# EAGLE schematic exp2_Blueberry Pi 7.1.2.licheepi-zero.esp32.no-lan.gsm-a9g.no-50p (EAGLE 6.1)

## Sheet 1 of 8: IO / LRADC / RTL8237BS / Touch / SPI Flash
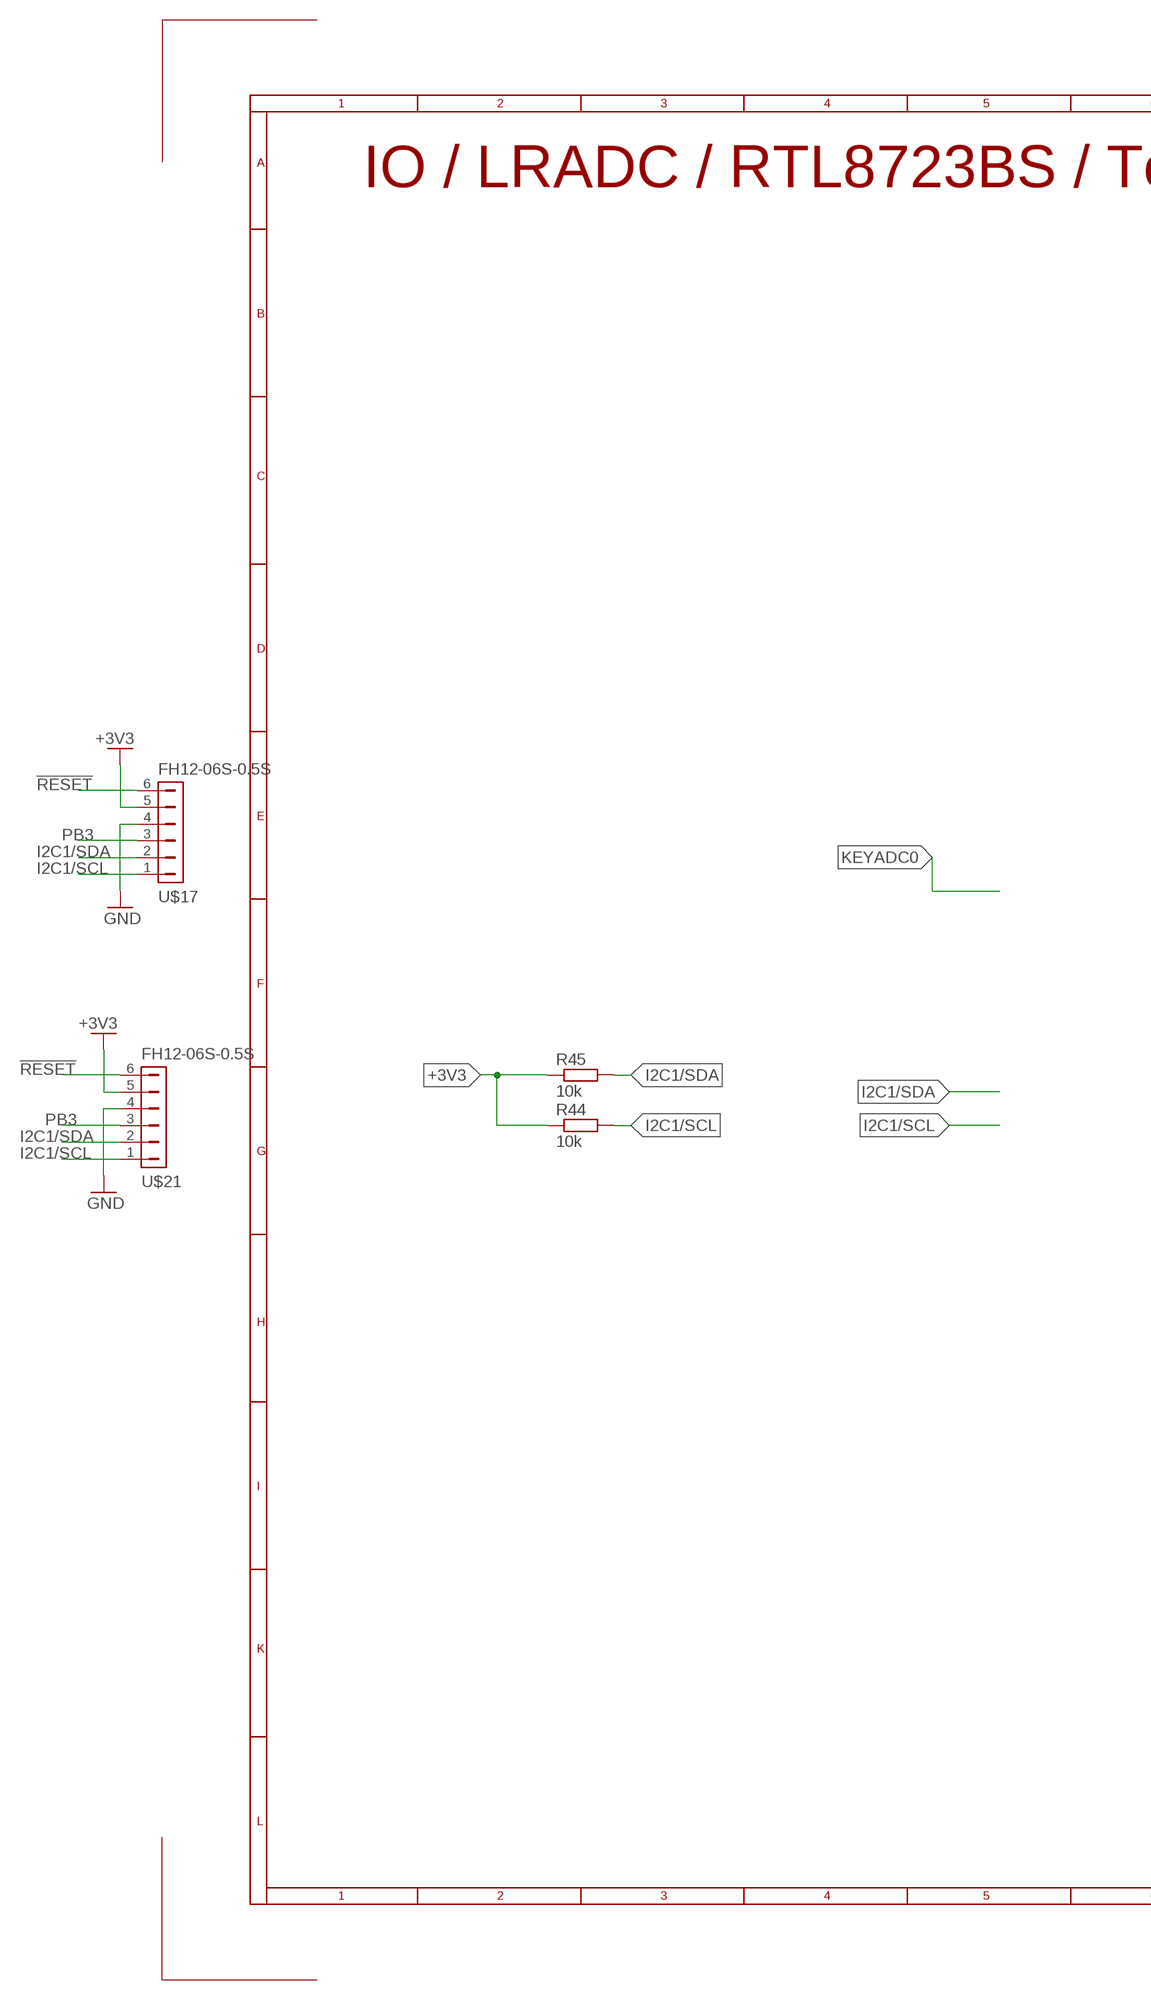
[diagram p0: schematic, sheet 1, part 1 of 2]
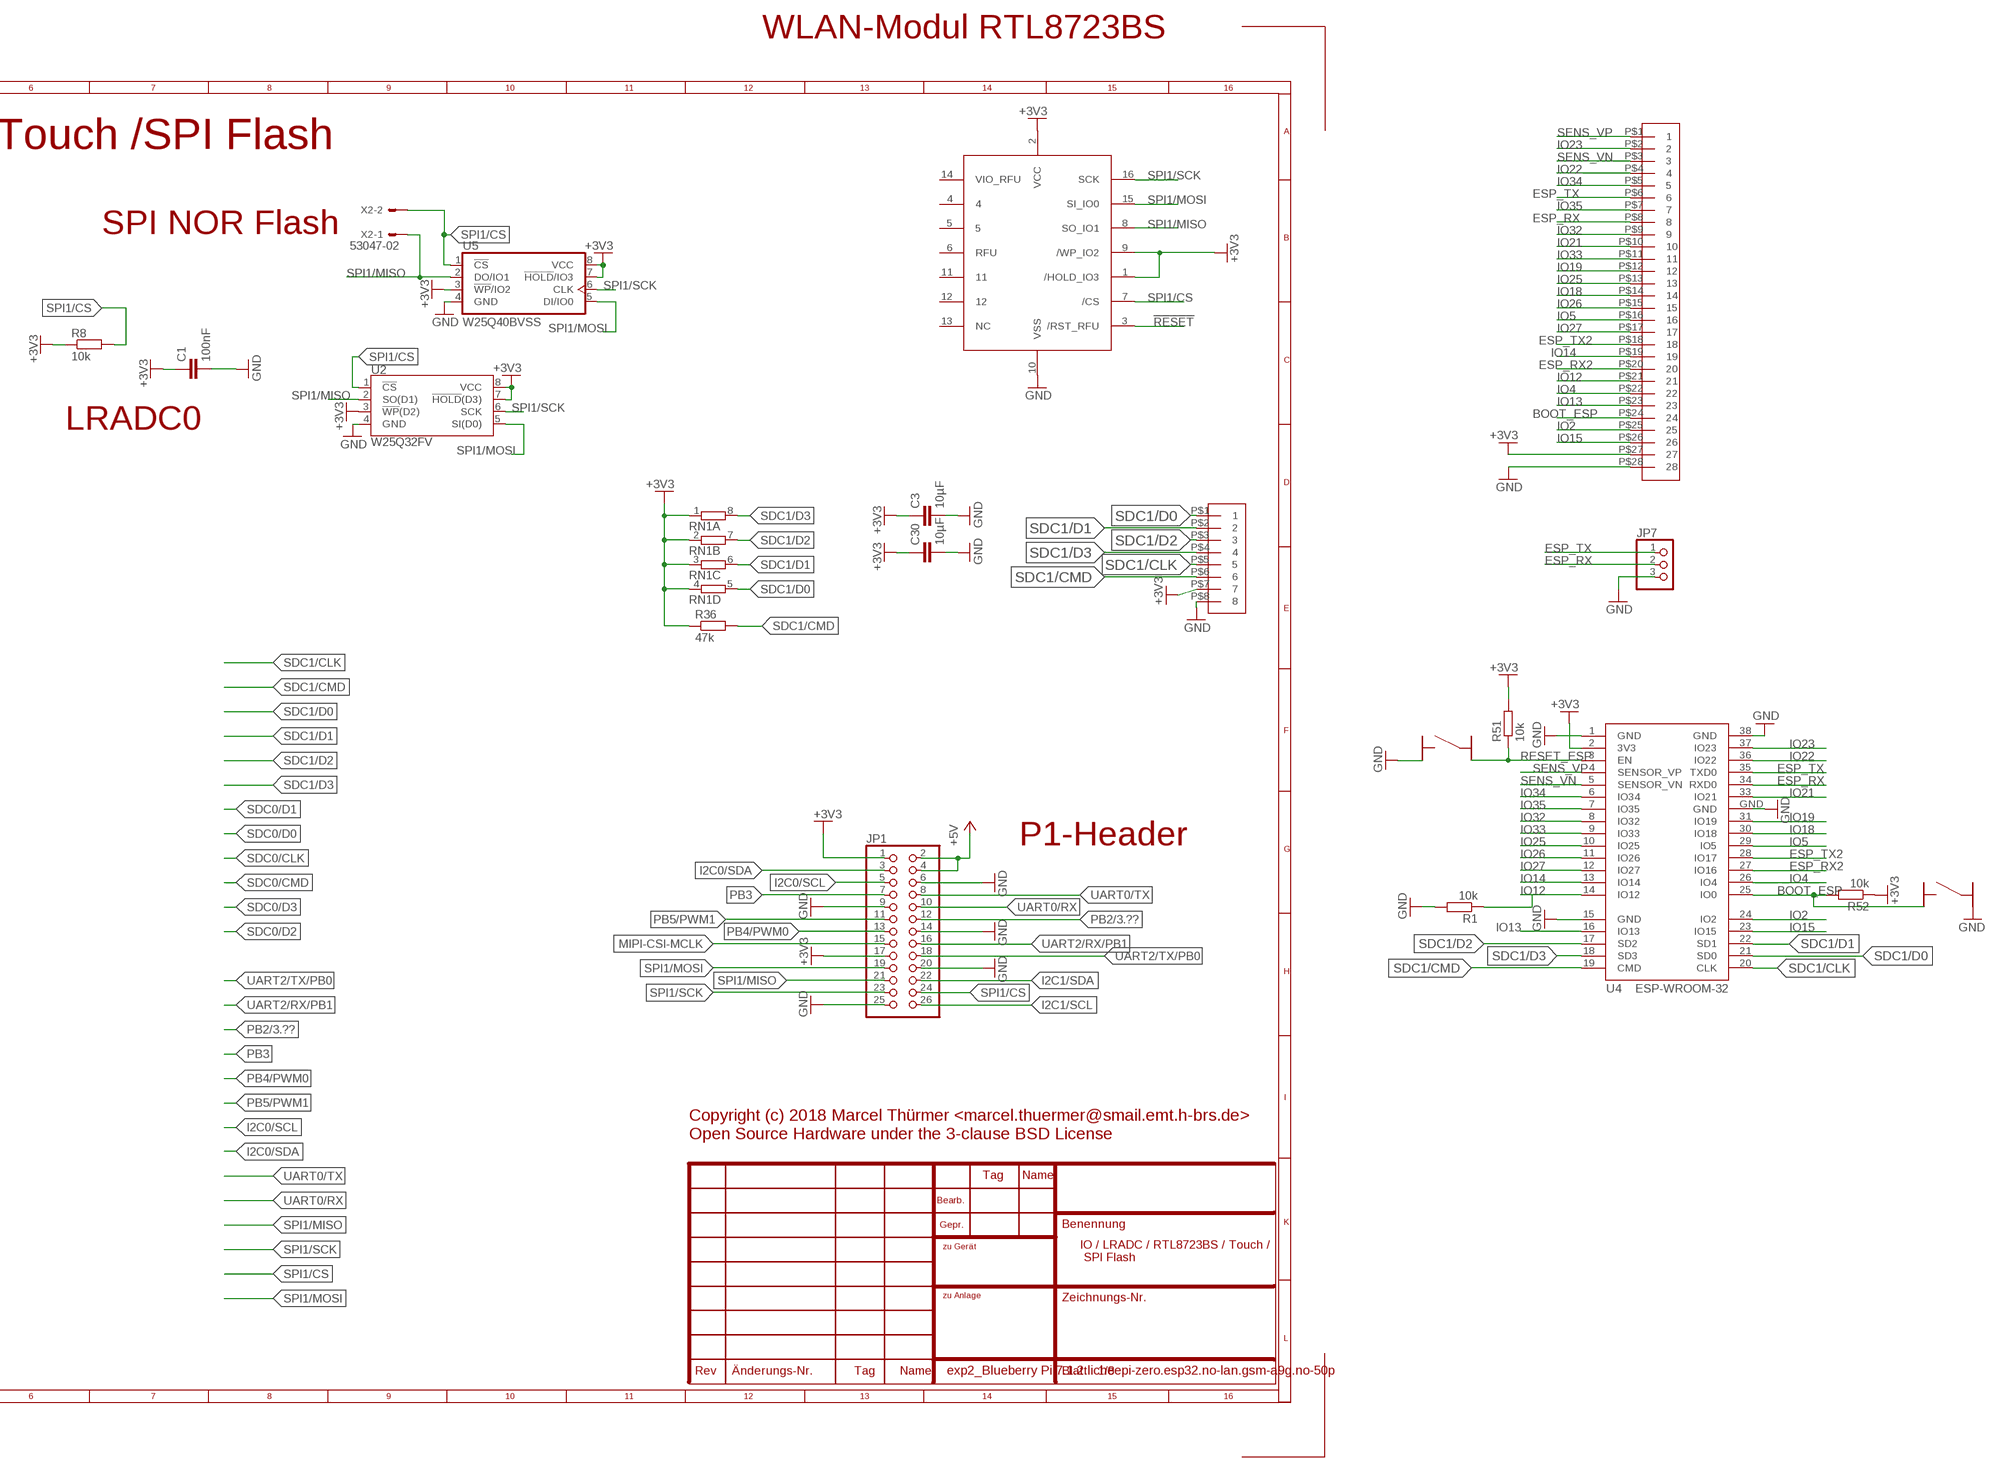
[diagram p1: schematic, sheet 1, part 2 of 2]

### Parts
C1  100nF  C-EUC0603  [C0603]
C3  10µF  C-EUC0805  [C0805]
C30  10µF  C-EUC0805  [C0805]
JP1  PINHD-2X13  [2X13]
JP7  PINHD-1X3M  [1X03M]
R1  10k  R-EU_R0603  [R0603]
R8  10k  R-EU_R0603  [R0603]
R36  47k  R-EU_R0603  [R0603]
R44  10k  R-EU_R0603  [R0603]
R45  10k  R-EU_R0603  [R0603]
R51  10k  R-EU_R0603  [R0603]
R52  10k  R-EU_R0603  [R0603]
RN1  4R-NEXB38V  [EXB38V]
S-BOOT-ESP  BUTTON_3X3MM_4PINS  [BUT_3X3_4PINS]
S-RST-ESP  BUTTON_3X3MM_4PINS  [BUT_3X3_4PINS]
U2  W25Q32FV  W25Q32FVZP  [WSON8-6X5MM]
U4  ESP-WROOM-32  [ESP-WROOM-32]
U5  W25Q40BVSS  [SO08-SS]
U$3  HDR-1.27MM-142  [HDR-1.27MM-19*2]
U$4  HDR-1.27MM-42  [HDR-1.27MM-4*2]
U$16  S25FL256S  S25FLSXXX  [WSOIC-16]
U$17  FH12-06S-0.5S  [FH12-6S-0.5SH]
U$21  FH12-06S-0.5S  [FH12-6S-0.5SH]
X2  53047-02  [53047-02]

### Nets
!RESET: U$16.3(/RST_RFU) U$17.6 U$21.6 ; also sheet 3
+3V3: C1.1 C3.1 C30.1 JP1.1 JP1.17 R8.1 R36.1 R44.1 R45.1 R51.2 R52.1 RN1.1 RN1.2 RN1.3 RN1.4 U2.3(!WP!(D2)) U2.7(!HOLD!(D3)) U2.8(VCC) U4.2(3V3) U5.3(!WP!/IO2) U5.7(!HOLD!/IO3) U5.8(VCC) U$3.P$27 U$4.P$7 U$16.1(/HOLD_IO3) U$16.2(VCC) U$16.9(/WP_IO2) U$17.5 U$21.5 ; also sheet 2,6,7,8
+5V: JP1.2 JP1.4 ; also sheet 2,3,5,8
BOOT_ESP: R52.2 S-BOOT-ESP.P$1 U4.25(IO0) U$3.P$24
ESP_RX: JP7.2 U4.34(RXD0) U$3.P$8
ESP_RX2: U4.27(IO16) U$3.P$20 ; also sheet 7
ESP_TX: JP7.1 U4.35(TXD0) U$3.P$6
ESP_TX2: U4.28(IO17) U$3.P$18 ; also sheet 7
GND: C1.2 C3.2 C30.2 JP1.6 JP1.9 JP1.14 JP1.20 JP1.25 JP7.3 R1.2 S-BOOT-ESP.P$2 S-RST-ESP.P$1 U2.4(GND) U4.1(GND) U4.15(GND) U4.38(GND) U4.GND U5.4(GND) U$3.P$28 U$4.P$8 U$16.10(VSS) U$17.4 U$21.4 ; also sheet 2,3,5,6,7,8
I2C0/SCL: JP1.5 ; also sheet 8
I2C0/SDA: JP1.3 ; also sheet 8
I2C1/SCL: JP1.26 R44.2 U$17.1 U$21.1 ; also sheet 8
I2C1/SDA: JP1.22 R45.2 U$17.2 U$21.2 ; also sheet 8
IO2: U4.24(IO2) U$3.P$25
IO4: U4.26(IO4) U$3.P$22
IO5: U4.29(IO5) U$3.P$16
IO12: R1.1 U4.14(IO12) U$3.P$21
IO13: U4.16(IO13) U$3.P$23
IO14: U4.13(IO14) U$3.P$19 ; also sheet 7
IO15: U4.23(IO15) U$3.P$26
IO18: U4.30(IO18) U$3.P$14
IO19: U4.31(IO19) U$3.P$12
IO21: U4.33(IO21) U$3.P$10
IO22: U4.36(IO22) U$3.P$4
IO23: U4.37(IO23) U$3.P$2
IO25: U4.10(IO25) U$3.P$13
IO26: U4.11(IO26) U$3.P$15
IO27: U4.12(IO27) U$3.P$17 ; also sheet 7
IO32: U4.8(IO32) U$3.P$9
IO33: U4.9(IO33) U$3.P$11
IO34: U4.6(IO34) U$3.P$5
IO35: U4.7(IO35) U$3.P$7
MIPI-CSI-MCLK: JP1.15
PB2: JP1.12 ; also sheet 3,8
PB3: JP1.7 U$17.3 U$21.3 ; also sheet 8
PB4/PWM0: JP1.13 ; also sheet 8
PB5/PWM1: JP1.11 ; also sheet 2,6,8
RESET_ESP: R51.1 S-RST-ESP.P$2 U4.3(EN)
SDC1/CLK: U4.20(CLK) U$4.P$5 ; also sheet 8
SDC1/CMD: R36.2 U4.19(CMD) U$4.P$6 ; also sheet 8
SDC1/D0: RN1.5 U4.21(SD0) U$4.P$1 ; also sheet 8
SDC1/D1: RN1.6 U4.22(SD1) U$4.P$2 ; also sheet 8
SDC1/D2: RN1.7 U4.17(SD2) U$4.P$3 ; also sheet 8
SDC1/D3: RN1.8 U4.18(SD3) U$4.P$4 ; also sheet 8
SENS_VN: U4.5(SENSOR_VN) U$3.P$3
SENS_VP: U4.4(SENSOR_VP) U$3.P$1
SPI1/CS: JP1.24 R8.2 U2.1(!CS!) U5.1(!CS!) U$16.7(/CS) X2.2 ; also sheet 8
SPI1/MISO: JP1.21 U2.2(SO(D1)) U5.2(DO/IO1) U$16.8(SO_IO1) X2.1 ; also sheet 8
SPI1/MOSI: JP1.19 U2.5(SI(D0)) U5.5(DI/IO0) U$16.15(SI_IO0) ; also sheet 8
SPI1/SCK: JP1.23 U2.6(SCK) U5.6(CLK) U$16.16(SCK) ; also sheet 8
UART0/RX: JP1.10 ; also sheet 8
UART0/TX: JP1.8 ; also sheet 8
UART2/RX/PB1: JP1.16 ; also sheet 7,8
UART2/TX/PB0: JP1.18 ; also sheet 7,8
Unconnected: S-BOOT-ESP.P$3 S-BOOT-ESP.P$4 S-RST-ESP.P$3 S-RST-ESP.P$4 U$16.4 U$16.5 U$16.6(RFU) U$16.11 U$16.12 U$16.13(NC) U$16.14(VIO_RFU)

### Notes on the sheet
- WLAN-Modul RTL8723BS
- IO / LRADC / RTL8723BS / Touch /SPI Flash
- SPI NOR Flash
- LRADC0
- P1-Header
- Copyright (c) 2018 Marcel Thürmer <marcel.thuermer@smail.emt.h-brs.de>
  Open Source Hardware under the 3-clause BSD License
- IO / LRADC / RTL8723BS / Touch /
   SPI Flash

## Sheet 2 of 8: Ethernet / USB Host / SDC0 / Audio / MIPI CSI
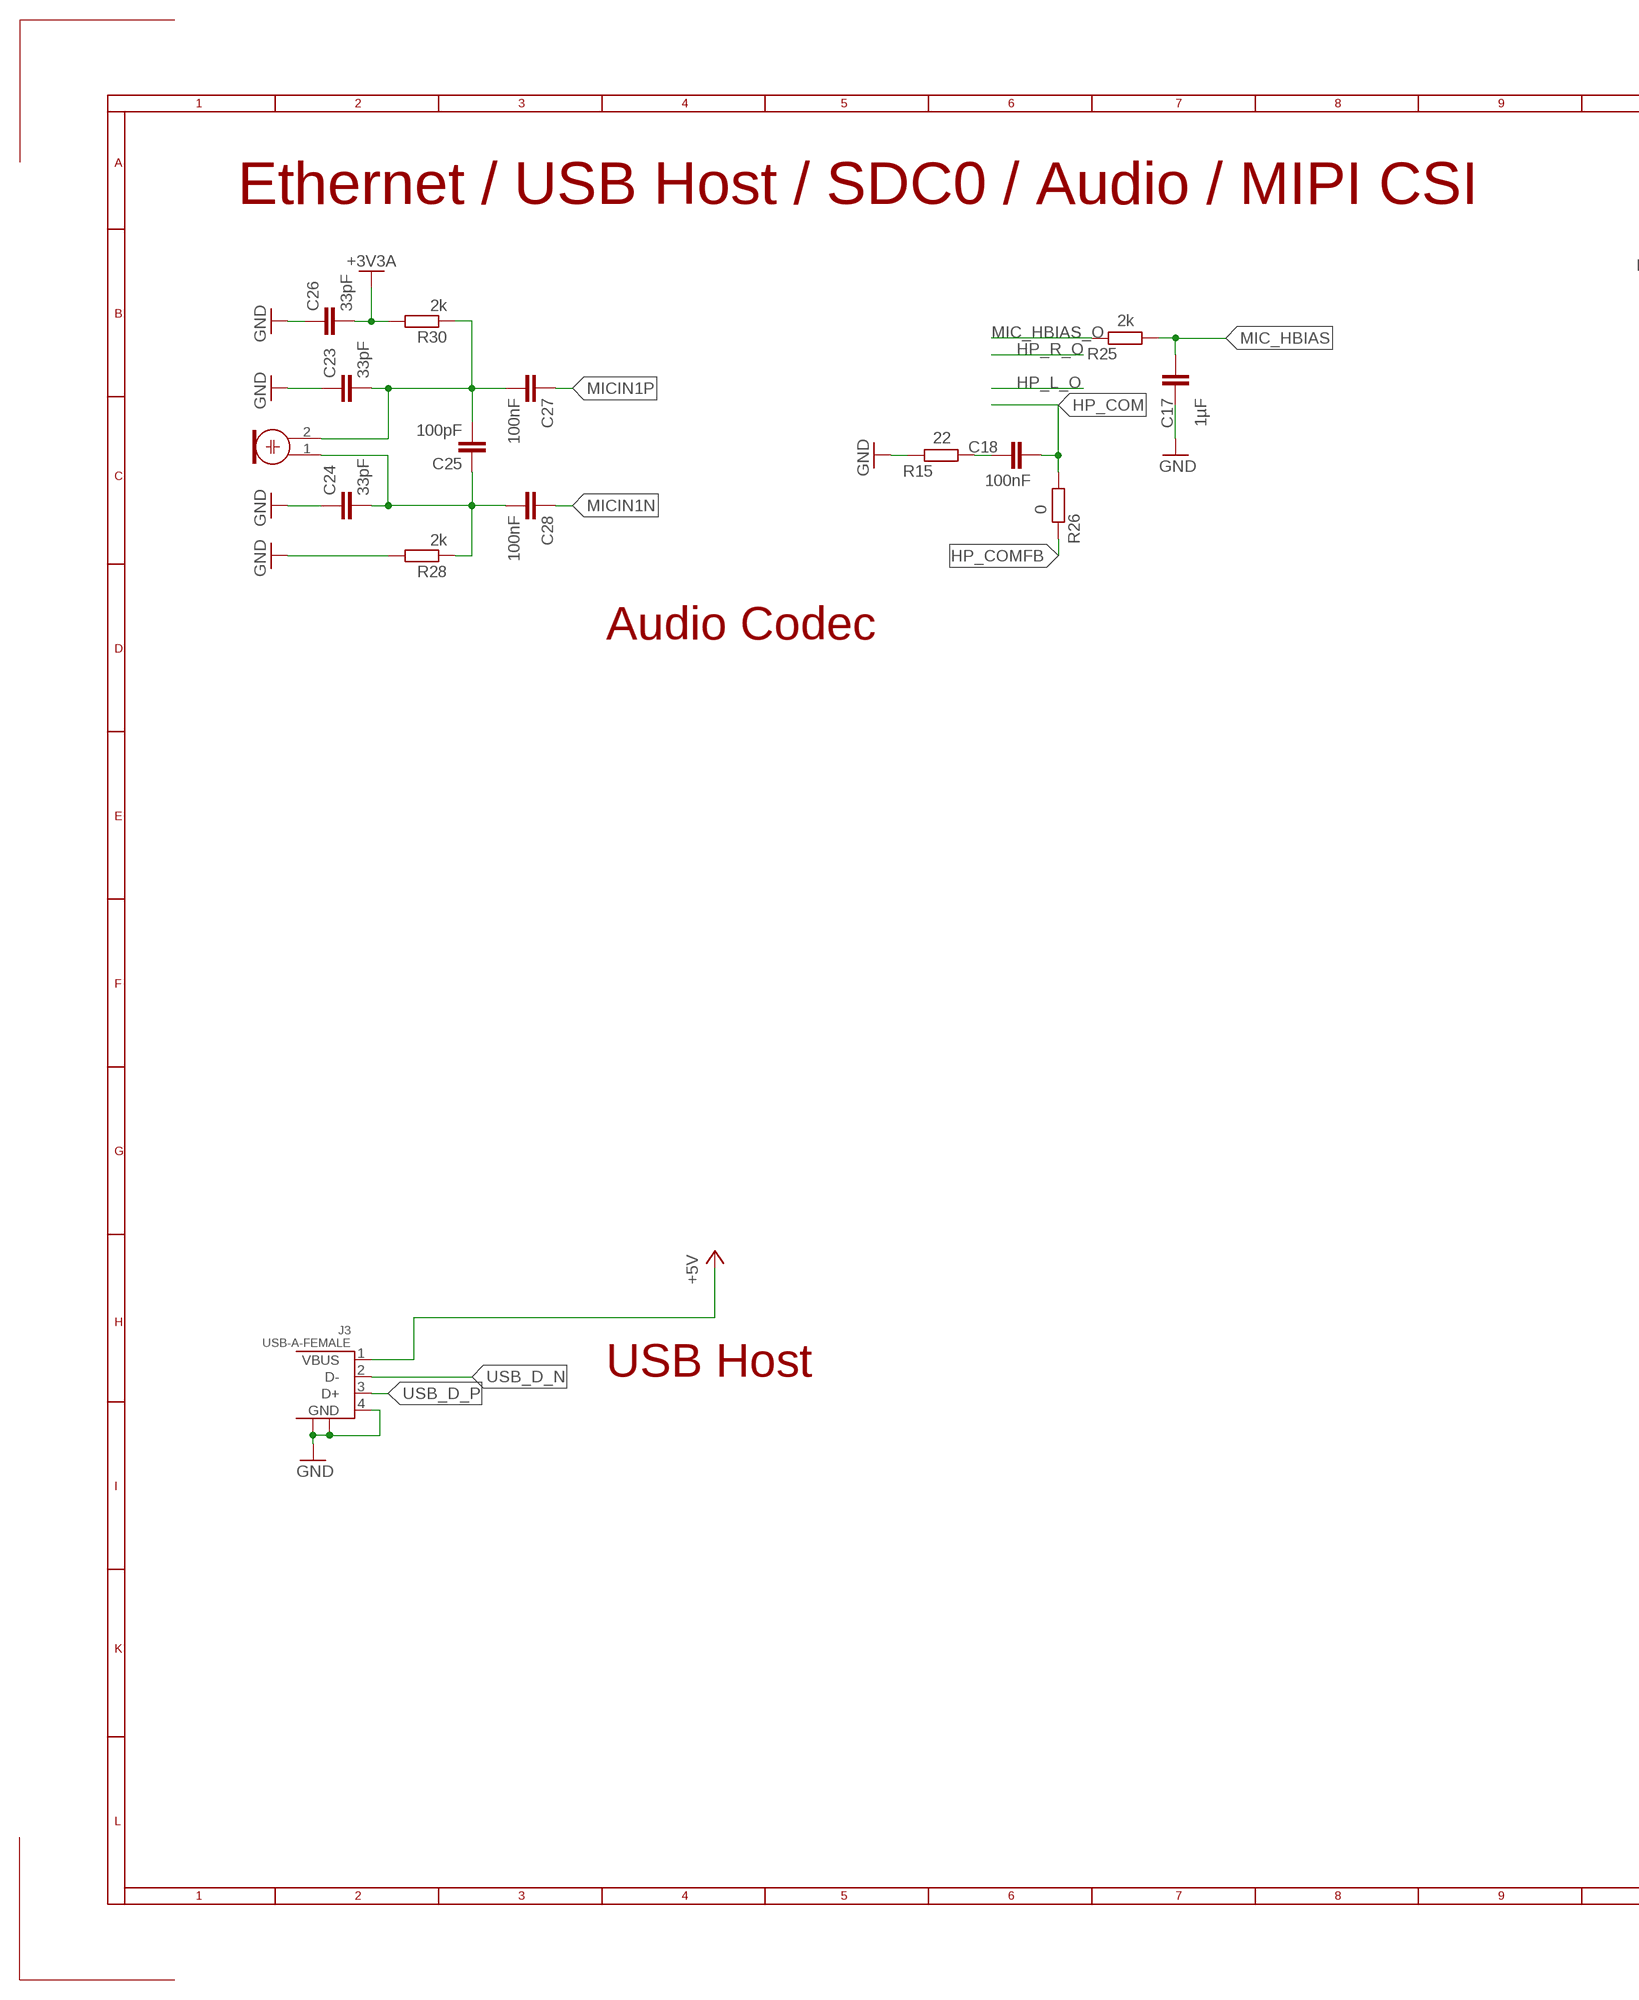
[diagram p2: schematic, sheet 2, part 1 of 2]
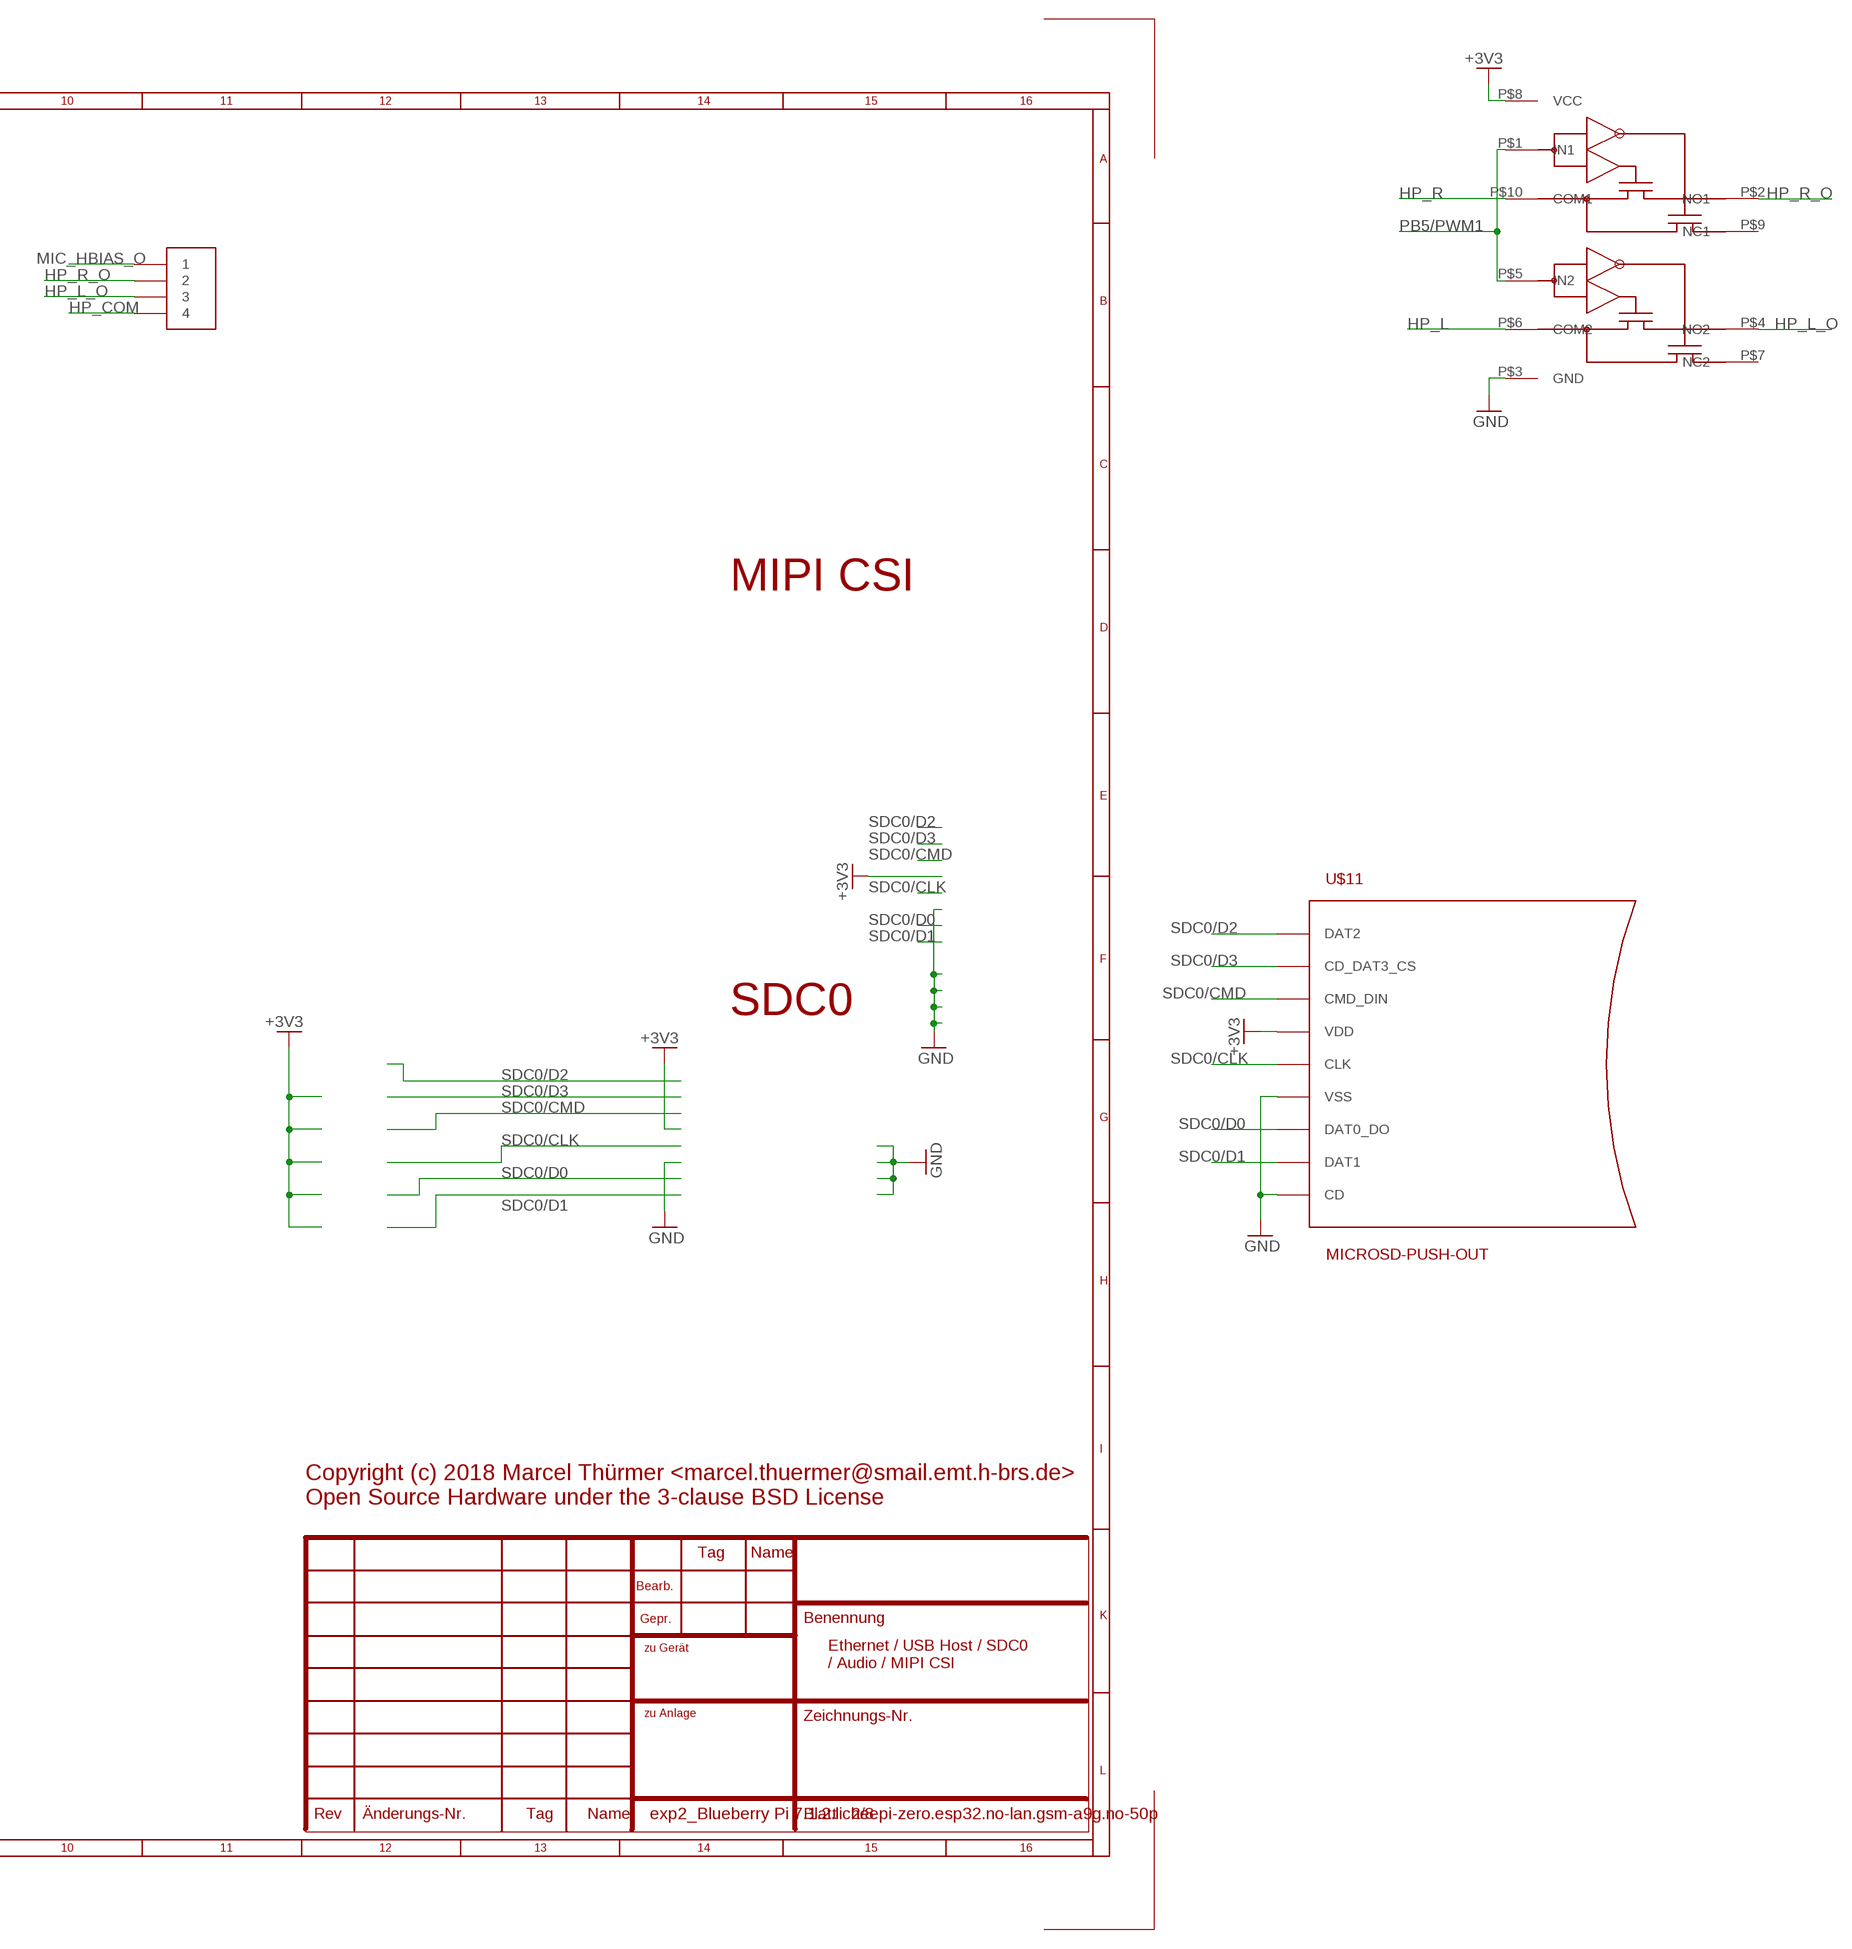
[diagram p3: schematic, sheet 2, part 2 of 2]

### Parts
C17  1µF  C-EUC0603  [C0603]
C18  100nF  C-EUC0603  [C0603]
C23  33pF  C-EUC0603  [C0603]
C24  33pF  C-EUC0603  [C0603]
C25  100pF  C-EUC0603  [C0603]
C26  33pF  C-EUC0603  [C0603]
C27  100nF  C-EUC0603  [C0603]
C28  100nF  C-EUC0603  [C0603]
J3  USB-A-FEMALE  [USB-A-FEMALE]
J-AUDIO  HDR-1.27MM-14  [HDR-1.27MM-1*4]
MIC  ELECTRET_MICROPHON-F6035AP  [F6035AP]
R15  22  R-EU_R0603  [R0603]
R25  2k  R-EU_R0603  [R0603]
R26  0  R-EU_R0603  [R0603]
R28  2k  R-EU_R0603  [R0603]
R30  2k  R-EU_R0603  [R0603]
U$11  MICROSD-PUSH-OUT  [MICROSD-PUSH-OUT]
U$24  TS5A23157  [TS5A23157]

### Nets
+3V3: U$11.4(VDD) U$24.P$8(VCC) ; also sheet 1,6,7,8
+3V3A: C26.2 R30.2
+5V: J3.1(VBUS) ; also sheet 1,3,5,8
GND: C17.2 C23.1 C24.1 C26.1 J3.4(GND) J3.P$1 J3.P$2 R15.1 R28.2 U$11.6(VSS) U$11.CD U$11.G1(VSS) U$11.G2(VSS) U$11.G3(VSS) U$11.G4(VSS) U$24.P$3(GND) ; also sheet 1,3,5,6,7,8
HP_COM: C18.2 J-AUDIO.P$4 R26.2 ; also sheet 8
HP_COMFB: R26.1 ; also sheet 8
HP_L: U$24.P$6(COM2) ; also sheet 8
HP_L_O: J-AUDIO.P$3 U$24.P$4(NO2)
HP_R: U$24.P$10(COM1) ; also sheet 6,8
HP_R_O: J-AUDIO.P$2 U$24.P$2(NO1)
MIC_HBIAS: C17.1 R25.2 ; also sheet 8
MIC_HBIAS_O: J-AUDIO.P$1 R25.1
MICIN1N: C28.1 ; also sheet 8
MICIN1P: C27.1 ; also sheet 6,8
N$47: C18.1 R15.2
N$48: C23.2 C25.2 C27.2 MIC.2 R30.1
N$49: C24.2 C25.1 C28.2 MIC.1 R28.1
PB5/PWM1: U$24.P$1(IN1) U$24.P$5(IN2) ; also sheet 1,6,8
SDC0/CLK: U$11.5(CLK) ; also sheet 1,8
SDC0/CMD: U$11.3(CMD_DIN) ; also sheet 1,8
SDC0/D0: U$11.7(DAT0_DO) ; also sheet 1,8
SDC0/D1: U$11.8(DAT1) ; also sheet 1,8
SDC0/D2: U$11.1(DAT2) ; also sheet 1,8
SDC0/D3: U$11.2(CD_DAT3_CS) ; also sheet 1,8
USB_D_N: J3.2(D-) ; also sheet 8
USB_D_P: J3.3(D+) ; also sheet 8
Unconnected: U$24.P$7(NC2) U$24.P$9(NC1)

### Notes on the sheet
- Ethernet / USB Host / SDC0 / Audio / MIPI CSI
- MIPI CSI
- Audio Codec
- SDC0
- USB Host
- Copyright (c) 2018 Marcel Thürmer <marcel.thuermer@smail.emt.h-brs.de>
  Open Source Hardware under the 3-clause BSD License
- Ethernet / USB Host / SDC0 
  / Audio / MIPI CSI

## Sheet 3 of 8: VCC / RTC / PLL
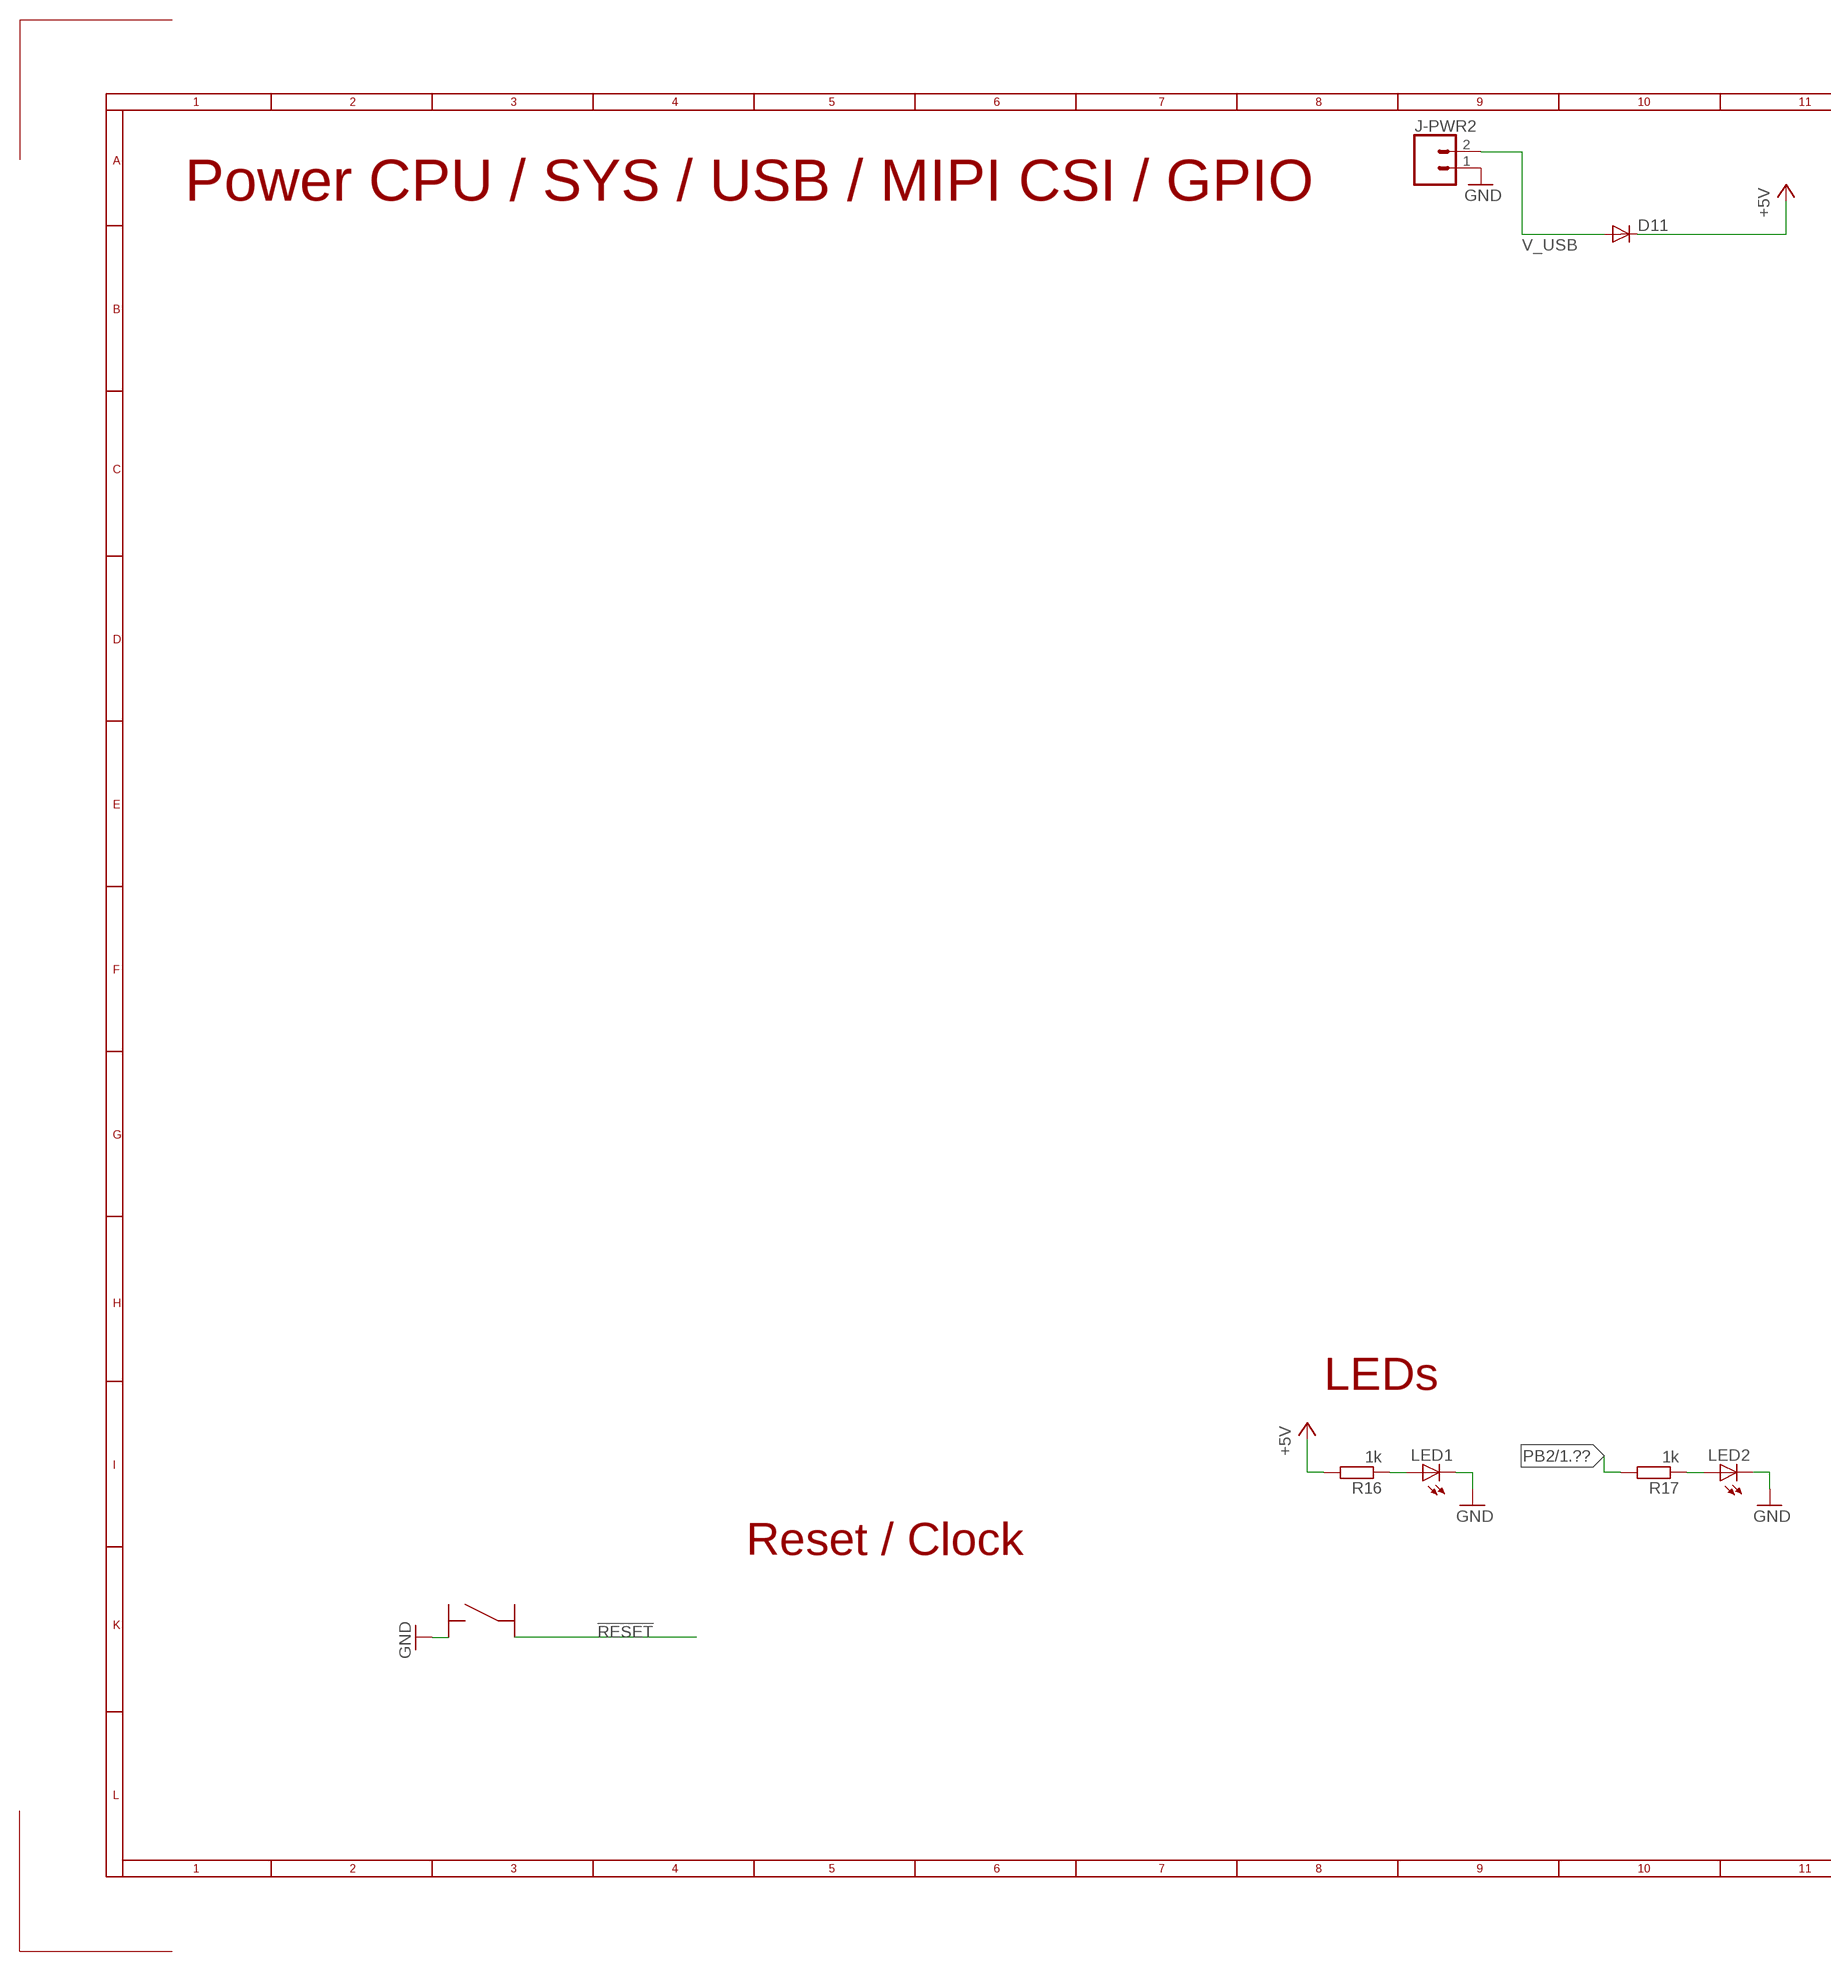
[diagram p4: schematic, sheet 3, part 1 of 2]
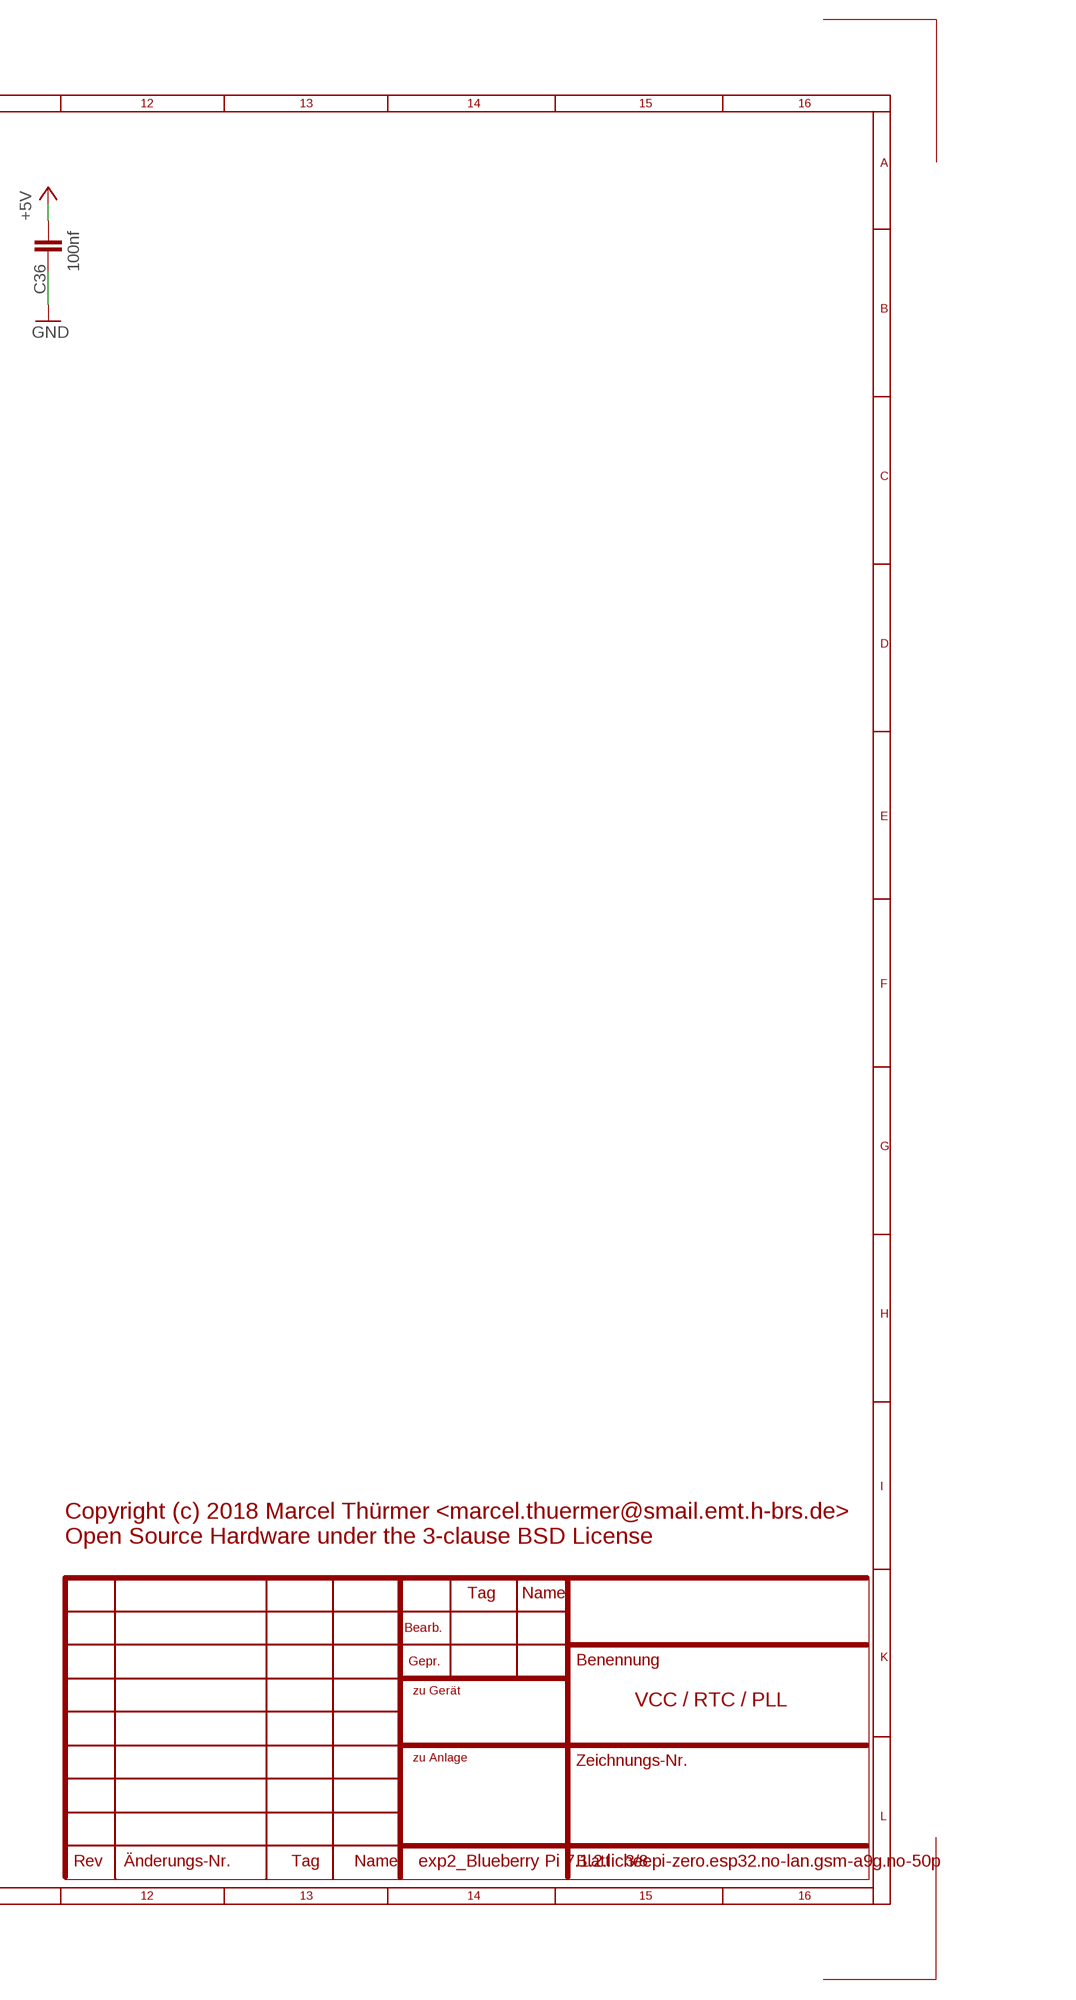
[diagram p5: schematic, sheet 3, part 2 of 2]

### Parts
C36  100nf  C-EUC0603  [C0603]
D11  DIODE-SOD323-W  [SOD323-W]
J-PWR2  CONN_02  [1X02]
LED1  LEDCHIPLED_0805  [CHIPLED_0805]
LED2  LEDCHIPLED_0805  [CHIPLED_0805]
R16  1k  R-EU_R0603  [R0603]
R17  1k  R-EU_R0603  [R0603]
S-RST  BUTTON_3X3MM_4PINS  [BUT_3X3_4PINS]

### Nets
!RESET: S-RST.P$2 ; also sheet 1
+5V: C36.1 D11.C R16.2 ; also sheet 1,2,5,8
GND: C36.2 J-PWR2.1 LED1.C LED2.C S-RST.P$1 ; also sheet 1,2,5,6,7,8
N$3: LED1.A R16.1
N$6: LED2.A R17.1
PB2: R17.2 ; also sheet 1,8
V_USB: D11.A J-PWR2.2 ; also sheet 5,7
Unconnected: S-RST.P$3 S-RST.P$4

### Notes on the sheet
- Power CPU / SYS / USB / MIPI CSI / GPIO
- LEDs
- Copyright (c) 2018 Marcel Thürmer <marcel.thuermer@smail.emt.h-brs.de>
  Open Source Hardware under the 3-clause BSD License
- Reset / Clock
- VCC / RTC / PLL

## Sheet 4 of 8
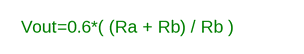
[diagram p6: schematic, sheet 4]

### Notes on the sheet
- Vout=0.6*( (Ra + Rb) / Rb )

## Sheet 5 of 8
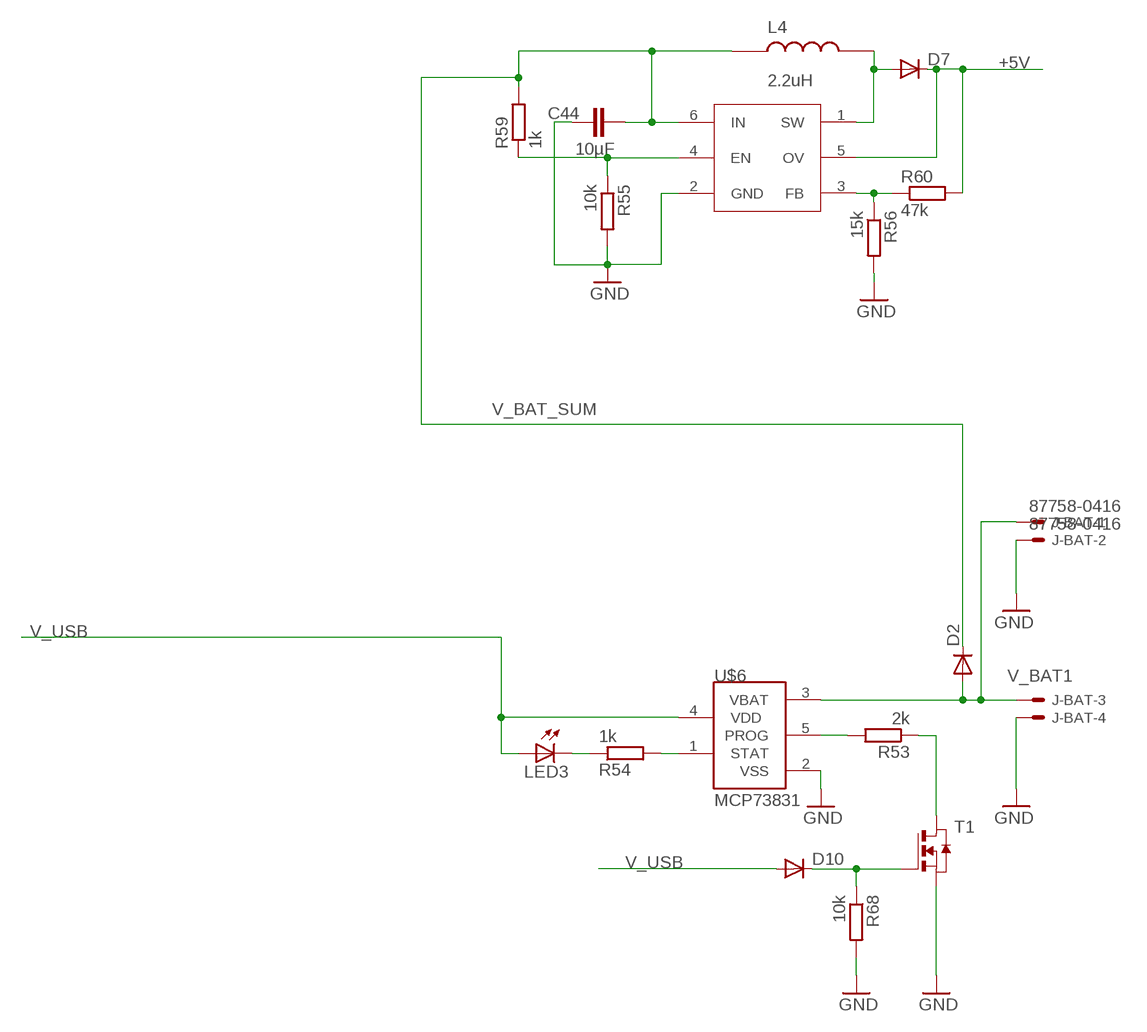
[diagram p7: schematic, sheet 5]

### Parts
C44  10µF  C-EUC0805  [C0805]
D2  DIODE-DO214AC  [DO214AC]
D7  DIODE-SOD323-W  [SOD323-W]
D10  DIODE-SOD323-W  [SOD323-W]
J-BAT  87758-0416  [87758-0416]
L4  2.2uH  INDUCTANCE_CD32  [CD32]
LED3  LEDCHIPLED_0805  [CHIPLED_0805]
R53  2k  R-EU_R0603  [R0603]
R54  1k  R-EU_R0603  [R0603]
R55  10k  R-EU_R0603  [R0603]
R56  15k  R-EU_R0603  [R0603]
R59  1k  R-EU_R0603  [R0603]
R60  47k  R-EU_R0603  [R0603]
R68  10k  R-EU_R0603  [R0603]
T1  NMOSSOT23  [SOT-23]
U$6  MCP73831  [SOT23-5L]
U$10  PT4101  [SOT23-6]

### Nets
+5V: D7.C R60.2 U$10.5(OV) ; also sheet 1,2,3,8
GND: C44.2 J-BAT.2 J-BAT.4 R55.2 R56.2 R68.2 T1.2(S) U$6.2(VSS) U$10.2(GND) ; also sheet 1,2,3,6,7,8
N$1: R53.1 T1.1(D)
N$7: R56.1 R60.1 U$10.3(FB)
N$12: R55.1 R59.1 U$10.4(EN)
N$13: D7.A L4.P$2 U$10.1(SW)
N$18: D10.C R68.1 T1.3(G)
N$19: R53.2 U$6.5(PROG)
N$35: LED3.C R54.1
N$38: R54.2 U$6.1(STAT)
V_BAT1: D2.A J-BAT.1 J-BAT.3 U$6.3(VBAT)
V_BAT_SUM: C44.1 D2.C L4.P$1 R59.2 U$10.6(IN) ; also sheet 7
V_USB: D10.A LED3.A U$6.4(VDD) ; also sheet 3,7

## Sheet 6 of 8
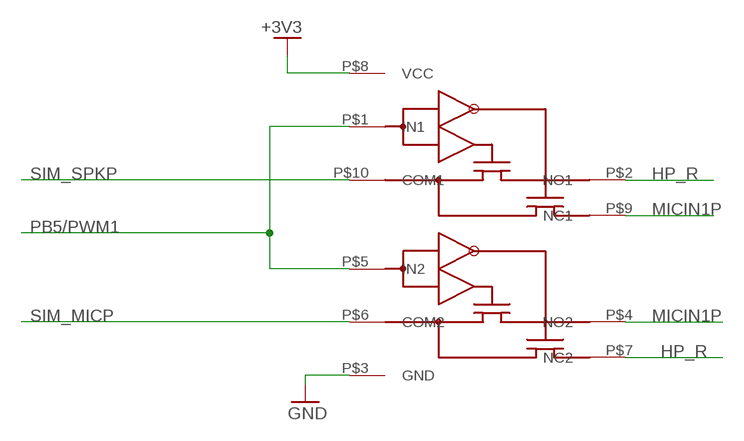
[diagram p8: schematic, sheet 6]

### Parts
U$19  TS5A23157  [TS5A23157]

### Nets
+3V3: U$19.P$8(VCC) ; also sheet 1,2,7,8
GND: U$19.P$3(GND) ; also sheet 1,2,3,5,7,8
HP_R: U$19.P$2(NO1) U$19.P$7(NC2) ; also sheet 2,8
MICIN1P: U$19.P$4(NO2) U$19.P$9(NC1) ; also sheet 2,8
PB5/PWM1: U$19.P$1(IN1) U$19.P$5(IN2) ; also sheet 1,2,8
SIM_MICP: U$19.P$6(COM2) ; also sheet 7
SIM_SPKP: U$19.P$10(COM1) ; also sheet 7

## Sheet 7 of 8
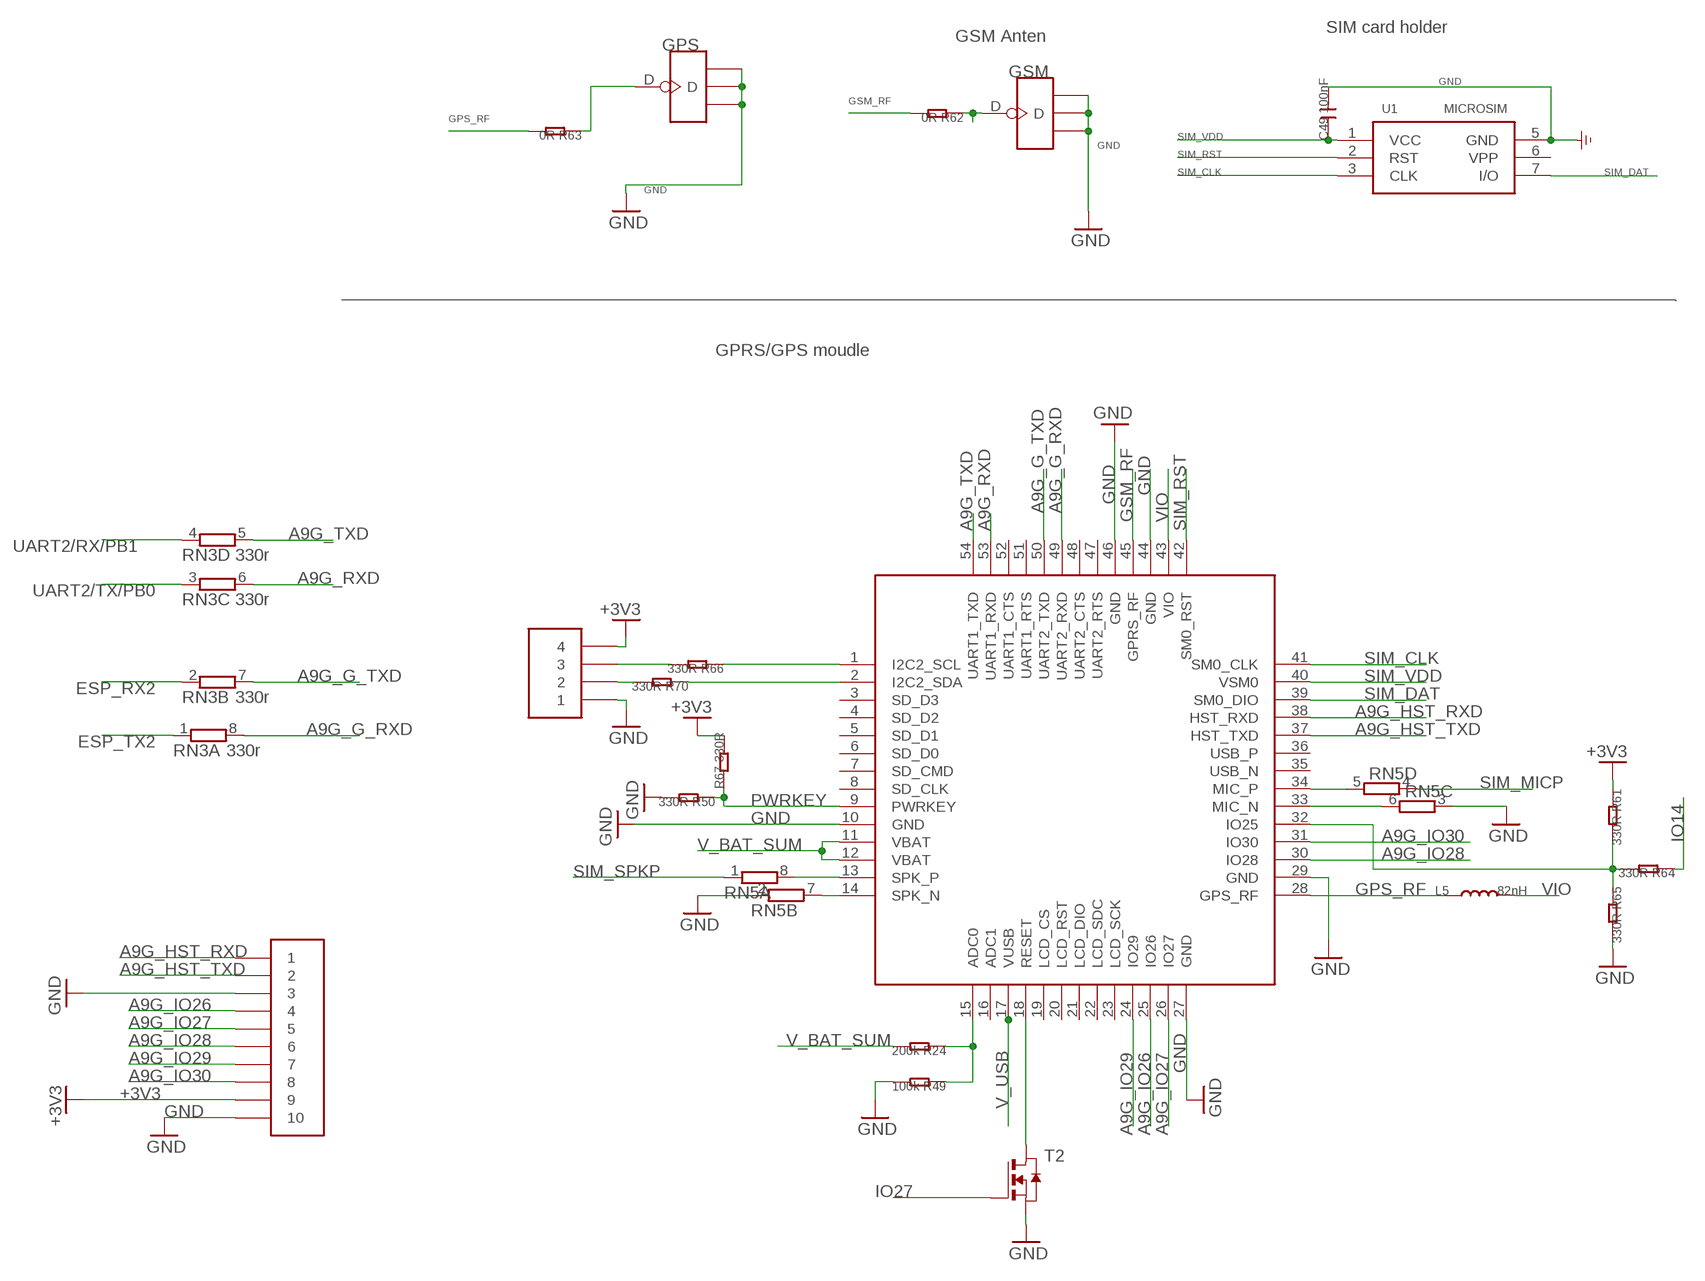
[diagram p9: schematic, sheet 7]

### Parts
C49  100nF  C-0603  [C0603]
DBG-COM1  HDR-1.27MM-110  [HDR-1.27MM-1*10]
GPS  ANTENNA-U-FL  [4P-U-FL]
GSM  ANTENNA-U-FL  [4P-U-FL]
L5  82nH  L'0603'  [L0603]
R24  200k  R-0603  [R0603]
R49  100k  R-0603  [R0603]
R50  330R  R-0603  [R0603]
R61  330R  R-0603  [R0603]
R62  0R  R-0603  [R0603]
R63  0R  R-0603  [R0603]
R64  330R  R-0603  [R0603]
R65  330R  R-0603  [R0603]
R66  330R  R-0603  [R0603]
R67  330R  R-0603  [R0603]
R70  330R  R-0603  [R0603]
RN3  330r  4R-NEXB38V  [EXB38V]
RN5  4R-NEXB38V  [EXB38V]
T2  NMOSSOT23  [SOT-23]
U1  MICROSIM  [MICROSIM]
U6  A9G  [A9G]
U$20  HDR-1.27MM-14  [HDR-1.27MM-1*4]

### Nets
+3V3: DBG-COM1.P$9 R61.1 R67.2 U$20.P$4 ; also sheet 1,2,6,8
A9G_G_RXD: RN3.8 U6.49(UART2_RXD)
A9G_G_TXD: RN3.7 U6.50(UART2_TXD)
A9G_HST_RXD: DBG-COM1.P$1 U6.38(HST_RXD)
A9G_HST_TXD: DBG-COM1.P$2 U6.37(HST_TXD)
A9G_IO26: DBG-COM1.P$4 U6.25(IO26)
A9G_IO27: DBG-COM1.P$5 U6.26(IO27)
A9G_IO28: DBG-COM1.P$6 U6.30(IO28)
A9G_IO29: DBG-COM1.P$7 U6.24(IO29)
A9G_IO30: DBG-COM1.P$8 U6.31(IO30)
A9G_RXD: RN3.6 U6.53(UART1_RXD)
A9G_TXD: RN3.5 U6.54(UART1_TXD)
ESP_RX2: RN3.2 ; also sheet 1
ESP_TX2: RN3.1 ; also sheet 1
GND: C49.2 DBG-COM1.P$3 DBG-COM1.P$10 GPS.GND1 GPS.GND2 GPS.GND3 GSM.GND1 GSM.GND2 GSM.GND3 R49.2 R50.2 R65.2 RN5.2 RN5.3 T2.2(S) U1.5(GND) U6.10(GND) U6.27(GND) U6.29(GND) U6.44(GND) U6.46(GND) U$20.P$1 ; also sheet 1,2,3,5,6,8
GPS_RF: L5.1 R63.2 U6.28(GPS_RF)
GSM_RF: R62.2 U6.45(GPRS_RF)
IO14: R64.1 ; also sheet 1
IO27: T2.3(G) ; also sheet 1
N$4: R24.1 R49.1 U6.15(ADC0)
N$14: RN5.6 U6.33(MIC_N)
N$20: RN5.7 U6.14(SPK_N)
N$21: R61.2 R64.2 R65.1 U6.32(IO25)
N$22: T2.1(D) U6.18(RESET)
N$39: RN5.8 U6.13(SPK_P)
N$40: R66.1 U6.1(I2C2_SCL)
N$44: GSM.D R62.1
N$45: GPS.D R63.1
N$52: R70.2 U$20.P$2
N$53: R70.1 U6.2(I2C2_SDA)
N$55: RN5.5 U6.34(MIC_P)
N$56: R66.2 U$20.P$3
PWRKEY: R50.1 R67.1 U6.9(PWRKEY)
SIM_CLK: U1.3(CLK) U6.41(SM0_CLK)
SIM_DAT: U1.7(I/O) U6.39(SM0_DIO)
SIM_MICP: RN5.4 ; also sheet 6
SIM_RST: U1.2(RST) U6.42(SM0_RST)
SIM_SPKP: RN5.1 ; also sheet 6
SIM_VDD: C49.1 U1.1(VCC) U6.40(VSM0)
UART2/RX/PB1: RN3.4 ; also sheet 1,8
UART2/TX/PB0: RN3.3 ; also sheet 1,8
V_BAT_SUM: R24.2 U6.11(VBAT) U6.12(VBAT) ; also sheet 5
V_USB: U6.17(VUSB) ; also sheet 3,5
VIO: L5.2 U6.43(VIO)
Unconnected: U1.6(VPP) U6.3(SD_D3) U6.4(SD_D2) U6.5(SD_D1) U6.6(SD_D0) U6.7(SD_CMD) U6.8(SD_CLK) U6.16(ADC1) U6.19(LCD_CS) U6.20(LCD_RST) U6.21(LCD_DIO) U6.22(LCD_SDC) U6.23(LCD_SCK) U6.35(USB_N) U6.36(USB_P) U6.47(UART2_RTS) U6.48(UART2_CTS) U6.51(UART1_RTS) U6.52(UART1_CTS)

### Notes on the sheet
- SIM card holder
- GSM Anten
- GPRS/GPS moudle

## Sheet 8 of 8: licheepi-zero
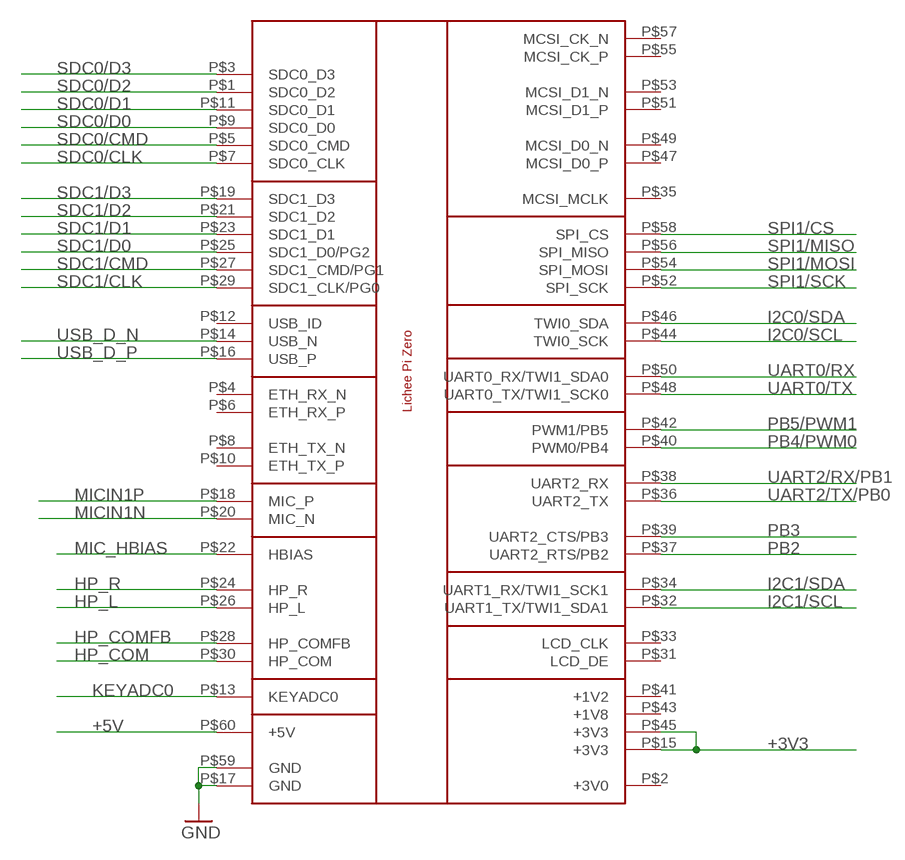
[diagram p10: schematic, sheet 8]

### Parts
U$22  LICHEE_ZERO  [LICHEE_ZERO]

### Nets
+3V3: U$22.P$15(+3V3) U$22.P$45(+3V3) ; also sheet 1,2,6,7
+5V: U$22.P$60(+5V) ; also sheet 1,2,3,5
GND: U$22.P$17(GND) U$22.P$59(GND) ; also sheet 1,2,3,5,6,7
HP_COM: U$22.P$30(HP_COM) ; also sheet 2
HP_COMFB: U$22.P$28(HP_COMFB) ; also sheet 2
HP_L: U$22.P$26(HP_L) ; also sheet 2
HP_R: U$22.P$24(HP_R) ; also sheet 2,6
I2C0/SCL: U$22.P$44(TWI0_SCK) ; also sheet 1
I2C0/SDA: U$22.P$46(TWI0_SDA) ; also sheet 1
I2C1/SCL: U$22.P$32(UART1_TX/TWI1_SDA1) ; also sheet 1
I2C1/SDA: U$22.P$34(UART1_RX/TWI1_SCK1) ; also sheet 1
KEYADC0: U$22.P$13(KEYADC0) ; also sheet 1
MIC_HBIAS: U$22.P$22(HBIAS) ; also sheet 2
MICIN1N: U$22.P$20(MIC_N) ; also sheet 2
MICIN1P: U$22.P$18(MIC_P) ; also sheet 2,6
PB2: U$22.P$37(UART2_RTS/PB2) ; also sheet 1,3
PB3: U$22.P$39(UART2_CTS/PB3) ; also sheet 1
PB4/PWM0: U$22.P$40(PWM0/PB4) ; also sheet 1
PB5/PWM1: U$22.P$42(PWM1/PB5) ; also sheet 1,2,6
SDC0/CLK: U$22.P$7(SDC0_CLK) ; also sheet 1,2
SDC0/CMD: U$22.P$5(SDC0_CMD) ; also sheet 1,2
SDC0/D0: U$22.P$9(SDC0_D0) ; also sheet 1,2
SDC0/D1: U$22.P$11(SDC0_D1) ; also sheet 1,2
SDC0/D2: U$22.P$1(SDC0_D2) ; also sheet 1,2
SDC0/D3: U$22.P$3(SDC0_D3) ; also sheet 1,2
SDC1/CLK: U$22.P$29(SDC1_CLK/PG0) ; also sheet 1
SDC1/CMD: U$22.P$27(SDC1_CMD/PG1) ; also sheet 1
SDC1/D0: U$22.P$25(SDC1_D0/PG2) ; also sheet 1
SDC1/D1: U$22.P$23(SDC1_D1) ; also sheet 1
SDC1/D2: U$22.P$21(SDC1_D2) ; also sheet 1
SDC1/D3: U$22.P$19(SDC1_D3) ; also sheet 1
SPI1/CS: U$22.P$58(SPI_CS) ; also sheet 1
SPI1/MISO: U$22.P$56(SPI_MISO) ; also sheet 1
SPI1/MOSI: U$22.P$54(SPI_MOSI) ; also sheet 1
SPI1/SCK: U$22.P$52(SPI_SCK) ; also sheet 1
UART0/RX: U$22.P$50(UART0_RX/TWI1_SDA0) ; also sheet 1
UART0/TX: U$22.P$48(UART0_TX/TWI1_SCK0) ; also sheet 1
UART2/RX/PB1: U$22.P$38(UART2_RX) ; also sheet 1,7
UART2/TX/PB0: U$22.P$36(UART2_TX) ; also sheet 1,7
USB_D_N: U$22.P$14(USB_N) ; also sheet 2
USB_D_P: U$22.P$16(USB_P) ; also sheet 2
Unconnected: U$22.P$2(+3V0) U$22.P$4(ETH_RX_N) U$22.P$6(ETH_RX_P) U$22.P$8(ETH_TX_N) U$22.P$10(ETH_TX_P) U$22.P$12(USB_ID) U$22.P$31(LCD_DE) U$22.P$33(LCD_CLK) U$22.P$35(MCSI_MCLK) U$22.P$41(+1V2) U$22.P$43(+1V8) U$22.P$47(MCSI_D0_P) U$22.P$49(MCSI_D0_N) U$22.P$51(MCSI_D1_P) U$22.P$53(MCSI_D1_N) U$22.P$55(MCSI_CK_P) U$22.P$57(MCSI_CK_N)

## Library data of the parts
C1 C3 C17 C18 C23-C28 C30 C36 C44 = rcl:C-EU: CAPACITOR, European symbol
C49 = Discrete:C*: Ceramic Capacitors
D2 D7 D10 D11 = diode:DIODE-: DIODE
DBG-COM1 = headers-1.27:HDR-1.27MM-1*10
GPS GSM = Connector:ANTENNA-U-FL
J3 = Connectors:USB
J-AUDIO U$20 = headers-1.27:HDR-1.27MM-1*4
J-BAT = con-molex:87758-0416: 4 Pin - 2mm Dual Row Single Wafer, Vertical T/H HDR Source: http://www.molex.com/pdm_docs/sd/877580616_sd.pdf; MF: FARNELL; MPN: 87758-0416; OC_FARNELL: 7472315; OC_NEWARK: 39K3681
J-PWR2 = SparkFun-Connectors:CONN_02: Multi connection point. Often used as Generic Header-pin footprint for 0.1 inch spaced/style header connections On any of the 0.1 inch spaced packages, you can populate with these: Break Away Headers - Straight <https://www.sparkfun.com/products/116> (PRT-00116) Break Away Male Headers - Right Angle <https://www.sparkfun.com/products/553> (PRT-00553) Female Headers <https://www.sparkfun.com/products/115> (PRT-00115) Break Away Headers - Machine Pin <https://www.sparkfun.com/products/117> (PRT-00117) Break Away Female Headers - Swiss Machine Pin <https://www.sparkfun.com/products/743> (PRT-00743) For SCREWTERMINALS and SPRING TERMINALS visit here: Screw Terimnals on SparkFun.com <https://www.sparkfun.com/search/results?term=Screw+Terminals> (5mm/3.5mm/2.54mm spacing) This device is also useful as a general connection point to wire up your design to another part of your project. Our various solder wires solder well into these plated through hole pads. Hook-Up Wire - Assortment (Stranded, 22 AWG) <https://www.sparkfun.com/products/11375> (PRT-11375) Hook-Up Wire - Assortment (Solid Core, 22 AWG) <https://www.sparkfun.com/products/11367> (PRT-11367) View the entire wire category on our website here <https://www.sparkfun.com/categories/141> Special notes: Molex polarized connector foot print use with: PRT-08233 with associated crimp pins and housings. 2.54_SCREWTERM for use with PRT-10571. 3.5mm Screw Terminal footprints for PRT-08084 5mm Screw Terminal footprints for use with PRT-08432
JP1 = pinhead:PINHD-2X13: PIN HEADER
JP7 = pinhead:PINHD-1X3: PIN HEADER
L4 = induct-CD:INDUCTANCE_CD32
L5 = Discrete:L*
LED1-LED3 = led:LED: LED OSRAM: - CHIPLED LG R971, LG N971, LY N971, LG Q971, LY Q971, LO R971, LY R971 LH N974, LH R974 LS Q976, LO Q976, LY Q976 LO Q996 - Hyper CHIPLED LW Q18S LB Q993, LB Q99A, LB R99A - SideLED LS A670, LO A670, LY A670, LG A670, LP A670 LB A673, LV A673, LT A673, LW A673 LH A674 LY A675 LS A676, LA A676, LO A676, LY A676, LW A676 LS A679, LY A679, LG A679 - Hyper Micro SIDELED® LS Y876, LA Y876, LO Y876, LY Y876 LT Y87S - SmartLED LW L88C, LW L88S LB L89C, LB L89S, LG L890 LS L89K, LO L89K, LY L89K LS L896, LA L896, LO L896, LY L896 - TOPLED LS T670, LO T670, LY T670, LG T670, LP T670 LSG T670, LSP T670, LSY T670, LOP T670, LYG T670 LG T671, LOG T671, LSG T671 LB T673, LV T673, LT T673, LW T673 LH T674 LS T676, LA T676, LO T676, LY T676, LB T676, LH T676, LSB T676, LW T676 LB T67C, LV T67C, LT T67C, LS T67K, LO T67K, LY T67K, LW E67C LS E67B, LA E67B, LO E67B, LY E67B, LB E67C, LV E67C, LT E67C LW T67C LS T679, LY T679, LG T679 LS T770, LO T770, LY T770, LG T770, LP T770 LB T773, LV T773, LT T773, LW T773 LH T774 LS E675, LA E675, LY E675, LS T675 LS T776, LA T776, LO T776, LY T776, LB T776 LHGB T686 LT T68C, LB T68C - Hyper Mini TOPLED® LB M676 - Mini TOPLED Santana® LG M470 LS M47K, LO M47K, LY M47K Source: http://www.osram.convergy.de LUXEON: - LUMILED® LXK2-PW12-R00, LXK2-PW12-S00, LXK2-PW14-U00, LXK2-PW14-V00 LXK2-PM12-R00, LXK2-PM12-S00, LXK2-PM14-U00 LXK2-PE12-Q00, LXK2-PE12-R00, LXK2-PE12-S00, LXK2-PE14-T00, LXK2-PE14-U00 LXK2-PB12-K00, LXK2-PB12-L00, LXK2-PB12-M00, LXK2-PB14-N00, LXK2-PB14-P00, LXK2-PB14-Q00 LXK2-PR12-L00, LXK2-PR12-M00, LXK2-PR14-Q00, LXK2-PR14-R00 LXK2-PD12-Q00, LXK2-PD12-R00, LXK2-PD12-S00 LXK2-PH12-R00, LXK2-PH12-S00 LXK2-PL12-P00, LXK2-PL12-Q00, LXK2-PL12-R00 Source: www.luxeon.com KINGBRIGHT: KA-3528ASYC Source: www.kingbright.com
MIC = microphon:ELECTRET_MICROPHON-: Electret Condenser Microphone
R1 R8 R15-R17 R25 R26 R28 R30 R36 R44 R45 R51-R56 R59 R60 R68 = rcl:R-EU_: RESISTOR, European symbol
R24 R49 R50 R61-R67 R70 = Discrete:R*
RN1 RN3 RN5 = resistor-dil:4R-N: Array Chip Resistor Source: RS Component / Phycomp; OC_FARNELL: unknown; OC_NEWARK: unknown
S-BOOT-ESP S-RST S-RST-ESP = my_but:BUTTON_3X3MM_4PINS
T1 T2 = zetex:NMOSSOT23: MOS FET; OC_FARNELL: unknown; OC_NEWARK: unknown
U1 = Connector:MICROSIM
U2 = SparkFun-IC-Memory:W25Q32FV: W25Q32FV 32Mb (4MB) Serial Flash Memory The W25Q32FV support the standard Serial Peripheral Interface (SPI), Dual/Quad I/O SPI as well as 2-clocks instruction cycle Quad Peripheral Interface (QPI). 104MHz, SPI, 8-SOIC-EIAJ Datasheet <http://www.winbond.com/resource-files/w25q32fv%20revh%20091613.pdf> SparkFun Products SparkFun Blynk Board - ESP8266 <https://www.sparkfun.com/products/13794> (WRL-13794); PROD_ID: NA-XXXXX
U4 = esp32-1:ESP-WROOM-32: Espressif Systems ESP-WROOM-32
U5 = memory-winbond:W25Q40BV: EEPROM 4 Mbit SPI Serial Flash with Dual and Quad SPI
U6 = IC:A9G
U$3 = headers-1.27:HDR-1.27MM-14*2
U$4 = headers-1.27:HDR-1.27MM-4*2
U$6 = mcp73831:MCP73831: Miniature Single-Cell, Fully Integrated Li-Ion, Li-Polymer Charge Management Controllers
U$10 = PT4101:PT4101
U$11 = microsd:MICROSD-PUSH-OUT: T-Flash Push-Out Micro SD Card Reader 14.75mm x 14.5mm SMD with external pins
U$16 = Synapseware:S25FLSXXX: S25FL128S and S25FL256S S25FL128S 128 Mbit (16 Mbyte) S25FL256S 256 Mbit (32 Mbyte) MirrorBit ® Flash Non-Volatile Memory CMOS 3.0 Volt Core with Versatile I/O Serial Peripheral Interface with Multi-I/O
U$17 U$21 = con-hirose:FH12-06S-0.5S
U$19 U$24 = ts5a23157:TS5A23157
U$22 = licheepi-zero2:LICHEE_ZERO
X2 = con-molex:53?-02: CONNECTOR wire to board 1.25 mm (.049 inch) pitch header; MF: MOLEX; MPN: 53047-0210; OC_FARNELL: 9733051; OC_NEWARK: 57H4701

## Net classes
0 default: clearance 0.355 mm